# Altium schematic sheet COMUNICATE_CON.SchDoc
size A; SheetNumber: 17; SheetTotal: 21
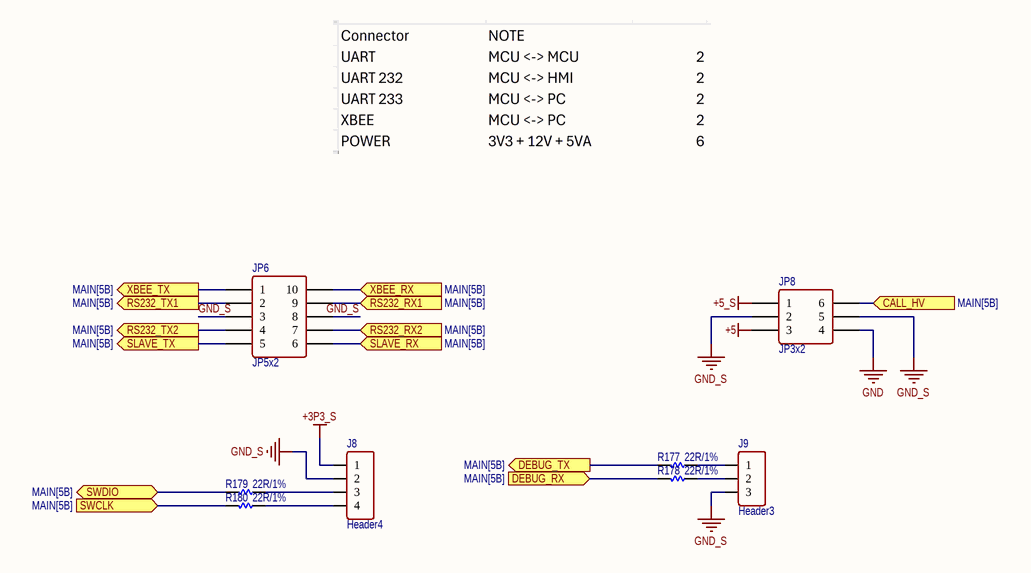
[diagram p0: COMUNICATE_CON.SchDoc]

## Parts
J8  Header4  [XH2.54-4-DIP]
J9  Header3  [XH2.54-3-DIP]
JP6  JP5x2  [JP5-D2T]
JP8  JP3x2  [JP3-C2T]
R177  22R/1%  [RES-SMD-0603]
R178  22R/1%  [RES-SMD-0603]
R179  22R/1%  [RES-SMD-0603]
R180  22R/1%  [RES-SMD-0603]

## Ports
CALL_HV (in, see MAIN[5B]), DEBUG_RX (in, see MAIN[5B]), DEBUG_TX (out, see MAIN[5B]), RS232_RX1 (in, see MAIN[5B]), RS232_RX2 (in, see MAIN[5B]), RS232_TX1 (out, see MAIN[5B]), RS232_TX2 (out, see MAIN[5B]), SLAVE_RX (in, see MAIN[5B]), SLAVE_TX (out, see MAIN[5B]), SWCLK (in, see MAIN[5B]), SWDIO (bidir, see MAIN[5B]), XBEE_RX (in, see MAIN[5B]), XBEE_TX (out, see MAIN[5B])

## Nets
+3P3_S: J8.1
+5: JP8.3
+5_S: JP8.1
GND: JP8.4
GND_S: J8.2 J9.3 JP6.3 JP6.8 JP8.2 JP8.5
CALL_HV: JP8.6 ; port CALL_HV
DEBUG_RX: R178.2 ; port DEBUG_RX
DEBUG_TX: R177.2 ; port DEBUG_TX
RS232_RX1: JP6.9 ; port RS232_RX1
RS232_RX2: JP6.7 ; port RS232_RX2
RS232_TX1: JP6.2 ; port RS232_TX1
RS232_TX2: JP6.4 ; port RS232_TX2
SLAVE_RX: JP6.6 ; port SLAVE_RX
SLAVE_TX: JP6.5 ; port SLAVE_TX
SWCLK: R180.2 ; port SWCLK
SWDIO: R179.2 ; port SWDIO
XBEE_RX: JP6.10 ; port XBEE_RX
XBEE_TX: JP6.1 ; port XBEE_TX
NetJ8_3: J8.3 R179.1
NetJ8_4: J8.4 R180.1
NetJ9_1: J9.1 R177.1
NetJ9_2: J9.2 R178.1

## Library data of the parts
J8 = Header4: Connector 4; Manufacturer: W¨¹rth Elektronik eiSos GmbH; partNo: 613002143121; ComponentLink1 Description: Manufacturer; ComponentLink2 Description: Datasheet; NoPins: 02; Created Date: 29 March 2013; ComponentLink1URL: http://www.we-online.com; ComponentLink2URL: http://katalog.we-online.de/em/datasheet/6130xx143121.pdf; Created by: Karrer Zheng
J9 = Header3: Connector 3; Manufacturer: W¨¹rth Elektronik eiSos GmbH; partNo: 613002143121; ComponentLink1 Description: Manufacturer; ComponentLink2 Description: Datasheet; NoPins: 02; Created Date: 29 March 2013; ComponentLink1URL: http://www.we-online.com; ComponentLink2URL: http://katalog.we-online.de/em/datasheet/6130xx143121.pdf; Created by: Karrer Zheng
JP6 = JP5x2: WR-PHD 2.54 mm Dual Socket Header; Manufacturer: W¨¹rth Elektronik eiSos GmbH; partNo: 61301021821; ComponentLink1 Description: Manufacturer; ComponentLink2 Description: Datasheet; NoPins: 10; Created Date: 29 March 2013; ComponentLink1URL: http://www.we-online.com; ComponentLink2URL: http://katalog.we-online.de/em/datasheet/6130xx21821.pdf; Created by: Karrer Zheng
JP8 = JP3x2: 5-534206-3; Manufacturer: W¨¹rth Elektronik eiSos GmbH; partNo: 61300621821; ComponentLink1 Description: Manufacturer; ComponentLink2 Description: Datasheet; NoPins: 06; Created Date: 29 March 2013; ComponentLink1URL: http://www.we-online.com; ComponentLink2URL: http://katalog.we-online.de/em/datasheet/6130xx21821.pdf; Created by: Karrer Zheng
R177-R180 = Res-SMD: ERJ-3EKF22R0V; PN: ERJ-3EKF22R0V